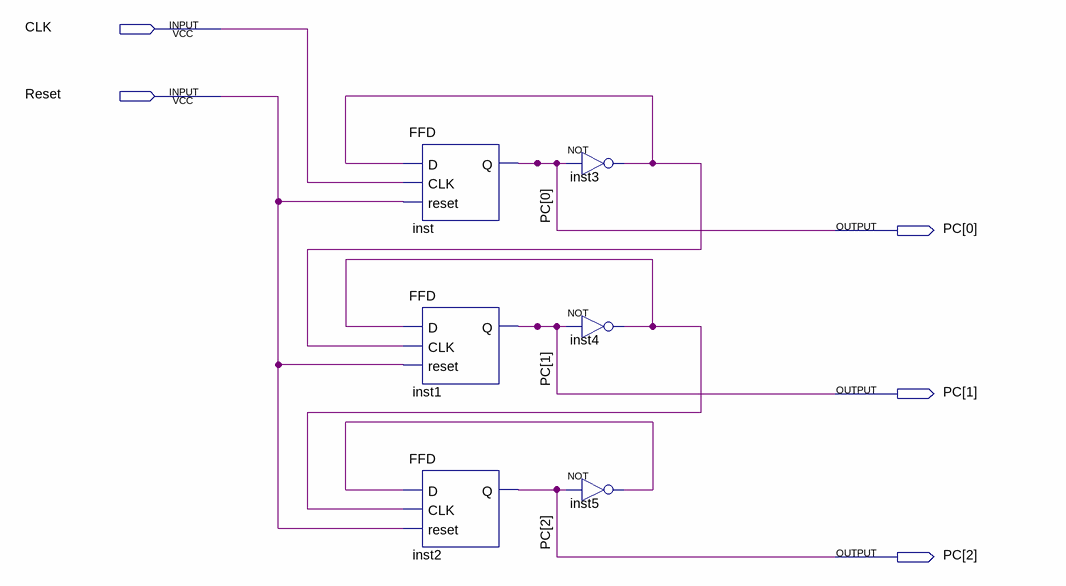
[diagram p0: schematic sheet]
// Quartus schematic CONTADOR_RIZO.bdf as structural Verilog: 6 symbols, 5 pins
module CONTADOR_RIZO (
  input  CLK,
  input  Reset,
  output [2:0] PC
);

  wire inst3_out, inst4_out, inst5_out;

  FFD inst (.D(inst3_out), .CLK(CLK), .reset(Reset), .Q(PC[0]));
  FFD inst1 (.D(inst4_out), .CLK(inst3_out), .reset(Reset), .Q(PC[1]));
  FFD inst2 (.D(inst5_out), .CLK(inst4_out), .reset(Reset), .Q(PC[2]));
  not inst3 (inst3_out, PC[0]);
  not inst4 (inst4_out, PC[1]);
  not inst5 (inst5_out, PC[2]);
endmodule
